# Altium schematic sheet 13_SPI_Flash.SchDoc
size A4
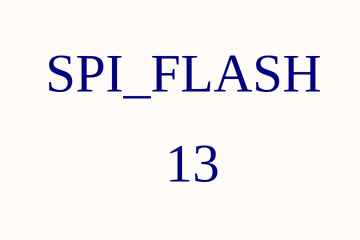
[diagram p0: 13_SPI_Flash.SchDoc]

## Notes on the sheet
- SPI_FLASH
- 13